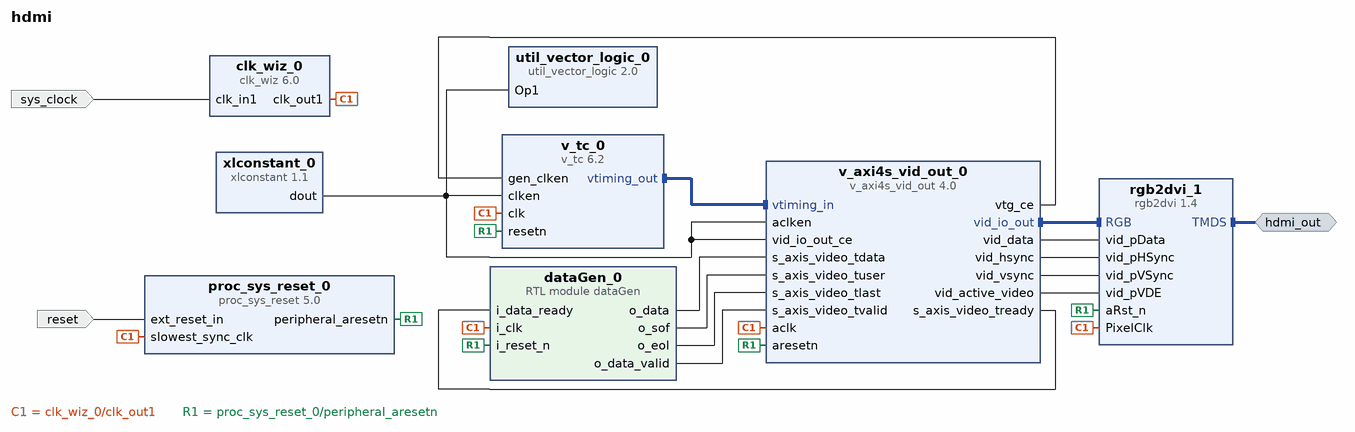
[diagram p0: block diagram of the top level]
# Vivado block design hdmi, xc7a200tsbg484-1, Vivado 2020.1
create_bd_design hdmi

create_bd_intf_port -mode Master -vlnv digilentinc.com:interface:tmds_rtl:1.0 hdmi_out
create_bd_port -dir I -type clk sys_clock
set_property -dict {CONFIG.FREQ_HZ 100000000 CONFIG.PHASE 0.000} [get_bd_ports sys_clock]
create_bd_port -dir I -type rst reset
set_property -dict {CONFIG.POLARITY ACTIVE_LOW} [get_bd_ports reset]

create_bd_cell -type ip -vlnv xilinx.com:ip:clk_wiz:6.0 clk_wiz_0
set_property -dict [list \
  CONFIG.CLKOUT1_JITTER 126.651 \
  CONFIG.CLKOUT1_PHASE_ERROR 104.359 \
  CONFIG.CLKOUT1_REQUESTED_OUT_FREQ 146 \
  CONFIG.CLKOUT1_REQUESTED_PHASE 0 \
  CONFIG.CLK_IN1_BOARD_INTERFACE sys_clock \
  CONFIG.MMCM_CLKFBOUT_MULT_F 9.125 \
  CONFIG.MMCM_CLKOUT0_DIVIDE_F 6.250 \
  CONFIG.MMCM_CLKOUT0_PHASE 0.000 \
  CONFIG.MMCM_DIVCLK_DIVIDE 1 \
  CONFIG.USE_BOARD_FLOW true \
  CONFIG.USE_LOCKED false \
  CONFIG.USE_RESET false \
] [get_bd_cells clk_wiz_0]
create_bd_cell -type ip -vlnv xilinx.com:ip:v_axi4s_vid_out:4.0 v_axi4s_vid_out_0
set_property -dict {CONFIG.C_HAS_ASYNC_CLK 0 CONFIG.C_VTG_MASTER_SLAVE 0} [get_bd_cells v_axi4s_vid_out_0]
create_bd_cell -type ip -vlnv xilinx.com:ip:v_tc:6.2 v_tc_0
set_property -dict [list \
  CONFIG.GEN_F0_VBLANK_HEND 960 \
  CONFIG.GEN_F0_VBLANK_HSTART 960 \
  CONFIG.GEN_F0_VFRAME_SIZE 1170 \
  CONFIG.GEN_F0_VSYNC_HEND 1004 \
  CONFIG.GEN_F0_VSYNC_HSTART 1004 \
  CONFIG.GEN_F0_VSYNC_VEND 1167 \
  CONFIG.GEN_F0_VSYNC_VSTART 1157 \
  CONFIG.GEN_HACTIVE_SIZE 912 \
  CONFIG.GEN_HFRAME_SIZE 1040 \
  CONFIG.GEN_HSYNC_END 1032 \
  CONFIG.GEN_HSYNC_START 968 \
  CONFIG.GEN_VACTIVE_SIZE 1140 \
  CONFIG.HAS_AXI4_LITE false \
  CONFIG.HAS_INTC_IF false \
  CONFIG.INTERLACE_EN false \
  CONFIG.SYNC_EN false \
  CONFIG.VIDEO_MODE Custom \
  CONFIG.enable_detection false \
  CONFIG.enable_generation true \
] [get_bd_cells v_tc_0]
create_bd_cell -type ip -vlnv digilentinc.com:ip:rgb2dvi:1.4 rgb2dvi_1
set_property -dict [list \
  CONFIG.TMDS_BOARD_INTERFACE hdmi_out \
  CONFIG.kClkPrimitive MMCM \
  CONFIG.kGenerateSerialClk true \
  CONFIG.kRstActiveHigh false \
] [get_bd_cells rgb2dvi_1]
create_bd_cell -type ip -vlnv xilinx.com:ip:proc_sys_reset:5.0 proc_sys_reset_0
set_property -dict {CONFIG.RESET_BOARD_INTERFACE reset CONFIG.USE_BOARD_FLOW true} [get_bd_cells proc_sys_reset_0]
create_bd_cell -type ip -vlnv xilinx.com:ip:xlconstant:1.1 xlconstant_0
set_property -dict {CONFIG.CONST_VAL 1 CONFIG.CONST_WIDTH 1} [get_bd_cells xlconstant_0]
create_bd_cell -type ip -vlnv xilinx.com:ip:util_vector_logic:2.0 util_vector_logic_0
set_property -dict {CONFIG.C_OPERATION not CONFIG.C_SIZE 1} [get_bd_cells util_vector_logic_0]
create_bd_cell -type module -reference dataGen dataGen_0

# ---- connections ----

connect_bd_intf_net [get_bd_intf_ports hdmi_out] [get_bd_intf_pins rgb2dvi_1/TMDS]
connect_bd_intf_net [get_bd_intf_pins v_tc_0/vtiming_out] [get_bd_intf_pins v_axi4s_vid_out_0/vtiming_in]
connect_bd_intf_net [get_bd_intf_pins v_axi4s_vid_out_0/vid_io_out] [get_bd_intf_pins rgb2dvi_1/RGB]
connect_bd_net [get_bd_ports sys_clock] [get_bd_pins clk_wiz_0/clk_in1]
connect_bd_net [get_bd_pins clk_wiz_0/clk_out1] \
  [get_bd_pins v_tc_0/clk] [get_bd_pins v_axi4s_vid_out_0/aclk] [get_bd_pins rgb2dvi_1/PixelClk] \
  [get_bd_pins proc_sys_reset_0/slowest_sync_clk] [get_bd_pins dataGen_0/i_clk]
connect_bd_net [get_bd_pins proc_sys_reset_0/peripheral_aresetn] \
  [get_bd_pins v_axi4s_vid_out_0/aresetn] [get_bd_pins v_tc_0/resetn] [get_bd_pins rgb2dvi_1/aRst_n] \
  [get_bd_pins dataGen_0/i_reset_n]
connect_bd_net [get_bd_ports reset] [get_bd_pins proc_sys_reset_0/ext_reset_in]
connect_bd_net [get_bd_pins dataGen_0/o_data] [get_bd_pins v_axi4s_vid_out_0/s_axis_video_tdata]
connect_bd_net [get_bd_pins v_axi4s_vid_out_0/s_axis_video_tready] [get_bd_pins dataGen_0/i_data_ready]
connect_bd_net [get_bd_pins dataGen_0/o_sof] [get_bd_pins v_axi4s_vid_out_0/s_axis_video_tuser]
connect_bd_net [get_bd_pins dataGen_0/o_eol] [get_bd_pins v_axi4s_vid_out_0/s_axis_video_tlast]
connect_bd_net [get_bd_pins dataGen_0/o_data_valid] [get_bd_pins v_axi4s_vid_out_0/s_axis_video_tvalid]
connect_bd_net [get_bd_pins v_axi4s_vid_out_0/vid_data] [get_bd_pins rgb2dvi_1/vid_pData]
connect_bd_net [get_bd_pins v_axi4s_vid_out_0/vid_hsync] [get_bd_pins rgb2dvi_1/vid_pHSync]
connect_bd_net [get_bd_pins v_axi4s_vid_out_0/vid_vsync] [get_bd_pins rgb2dvi_1/vid_pVSync]
connect_bd_net [get_bd_pins v_axi4s_vid_out_0/vid_active_video] [get_bd_pins rgb2dvi_1/vid_pVDE]
connect_bd_net [get_bd_pins v_axi4s_vid_out_0/vtg_ce] [get_bd_pins v_tc_0/gen_clken]
connect_bd_net [get_bd_pins xlconstant_0/dout] \
  [get_bd_pins util_vector_logic_0/Op1] [get_bd_pins v_tc_0/clken] [get_bd_pins v_axi4s_vid_out_0/aclken] \
  [get_bd_pins v_axi4s_vid_out_0/vid_io_out_ce]

validate_bd_design
save_bd_design
